# EAGLE design Adafruit_2.2_SPI_240x320 (EAGLE 6.3)
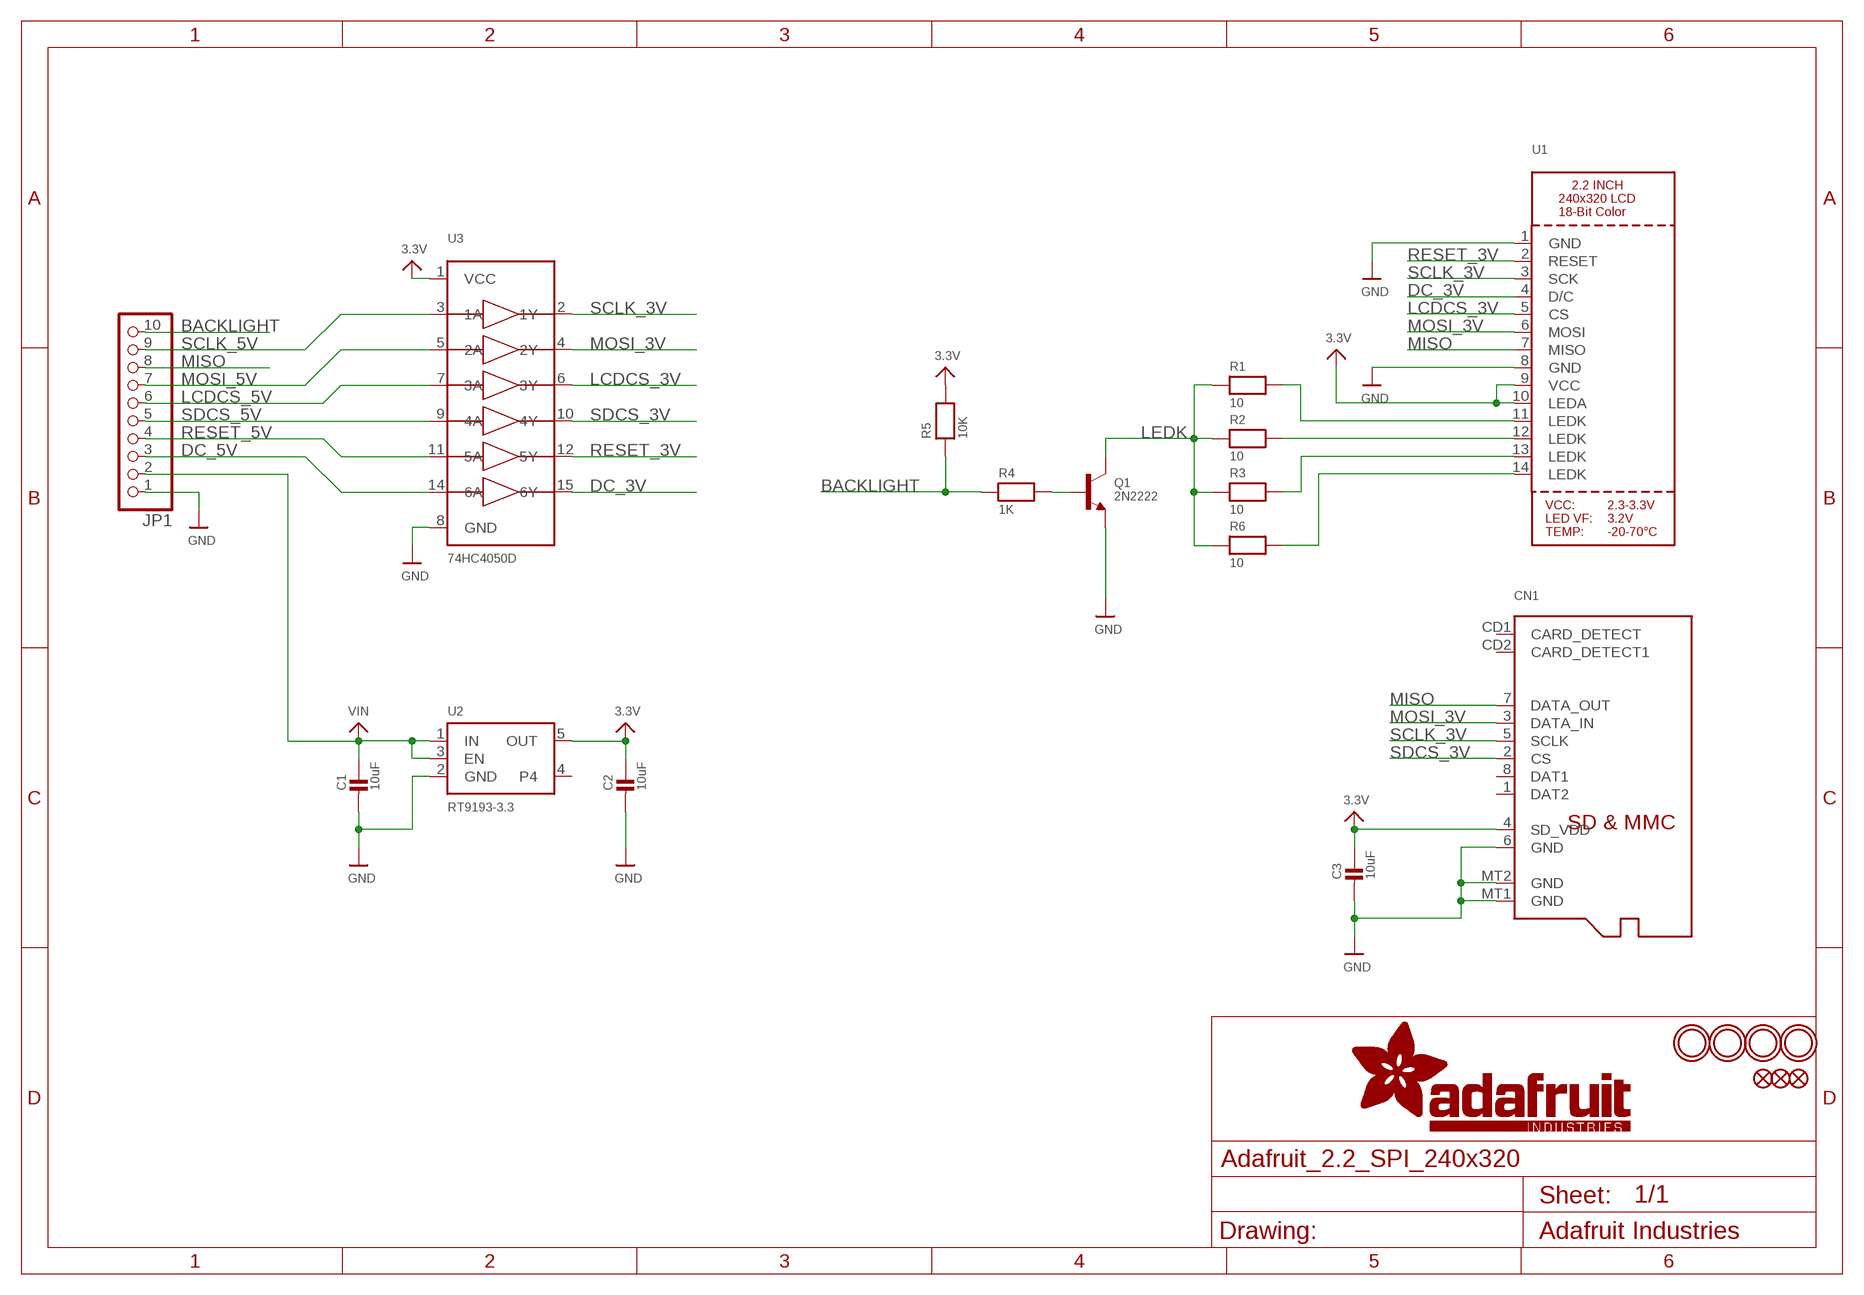
[diagram p0: schematic, sheet 1]

## Parts
C1  10uF  CAP_CERAMIC_0805MP  [_0805MP]
C2  10uF  CAP_CERAMIC_0805MP  [_0805MP]
C3  10uF  CAP_CERAMIC_0805MP  [_0805MP]
CN1  MICROSD  [MICROSD]
FID1  FIDUCIAL""  [FIDUCIAL_1MM]
FID2  FIDUCIAL""  [FIDUCIAL_1MM]
FID3  FIDUCIAL""  [FIDUCIAL_1MM]
JP1  HEADER-1X1070MIL  [1X10_ROUND70]
Q1  2N2222  TRANSISTOR_NPNWIDE  [SOT23-WIDE]
R1  10  RESISTOR_0805MP  [_0805MP]
R2  10  RESISTOR_0805MP  [_0805MP]
R3  10  RESISTOR_0805MP  [_0805MP]
R4  1K  RESISTOR_0805MP  [_0805MP]
R5  10K  RESISTOR_0805MP  [_0805MP]
R6  10  RESISTOR_0805MP  [_0805MP]
U1  DISP_LCD_TM022HDH26  [TM022HDH26_2.2IN_LCD]
U2  RT9193-3.3  VREG_SOT23-5  [SOT23-5]
U3  74HC4050D  [SOIC16]
U$2  MOUNTINGHOLE2.5  [MOUNTINGHOLE_2.5_PLATED]
U$3  MOUNTINGHOLE2.5  [MOUNTINGHOLE_2.5_PLATED]
U$4  MOUNTINGHOLE2.5  [MOUNTINGHOLE_2.5_PLATED]
U$5  MOUNTINGHOLE2.5  [MOUNTINGHOLE_2.5_PLATED]

## Nets
3.3V: C2.1 C3.1 CN1.4(SD_VDD) R5.2 U1.9(VCC) U1.10(LEDA) U2.5(OUT) U3.1(VCC)
BACKLIGHT: JP1.10 R4.1 R5.1
DC_3V: U1.4(D/C) U3.15(6Y)
DC_5V: JP1.3 U3.14(6A)
GND: C1.2 C2.2 C3.2 CN1.6(GND) CN1.MT1(GND) CN1.MT2(GND) JP1.1 Q1.2(E) U1.1(GND) U1.8(GND) U2.2(GND) U3.8(GND)
LCDCS_3V: U1.5(CS) U3.6(3Y)
LCDCS_5V: JP1.6 U3.7(3A)
LEDK: Q1.3(C) R1.1 R2.1 R3.1 R6.1
MISO: CN1.7(DATA_OUT) JP1.8 U1.7(MISO)
MOSI_3V: CN1.3(DATA_IN) U1.6(MOSI) U3.4(2Y)
MOSI_5V: JP1.7 U3.5(2A)
N$1: R1.2 U1.11(LEDK)
N$2: R2.2 U1.12(LEDK)
N$3: R3.2 U1.13(LEDK)
N$4: Q1.1(B) R4.2
N$5: R6.2 U1.14(LEDK)
RESET_3V: U1.2(RESET) U3.12(5Y)
RESET_5V: JP1.4 U3.11(5A)
SCLK_3V: CN1.5(SCLK) U1.3(SCK) U3.2(1Y)
SCLK_5V: JP1.9 U3.3(1A)
SDCS_3V: CN1.2(CS) U3.10(4Y)
SDCS_5V: JP1.5 U3.9(4A)
VIN: C1.1 JP1.2 U2.1(IN) U2.3(EN)
Unconnected: CN1.1(DAT2) CN1.8(DAT1) CN1.CD1(CARD_DETECT) CN1.CD2(CARD_DETECT1) U2.4

## Library data of the parts
C1-C3 = microbuilder:CAP_CERAMIC: Ceramic Capacitors For new designs, use the packages preceded by an '_' character since they are more reliable: The following footprints should be used on most boards: _0402 - Standard footprint for regular board layouts _0603 - Standard footprint for regular board layouts _0805 - Standard footprint for regular board layouts For extremely tight-pitch boards where space is at a premium, the following 'micro-pitch' footprints can be used (smaller pads, no silkscreen outline, etc.): _0402MP - Micro-pitch footprint for very dense/compact boards _0603MP - Micro-pitch footprint for very dense/compact boards _0805MP - Micro-pitch footprint for very dense/compact boards Commonly Stocked Parts 0402 - 0402 Surface Mount Capacitors 16pF 50V 5% [Digikey: 445-4899-2-ND] 18pF 50V 5% [Digikey: 490-1281-2-ND] 22pF 50V 5% [Digikey: 490-1283-2-ND] 68pF 50V 5% [Digikey: 490-1289-2-ND] 0.1uF 10V 10% [Digikey: 490-1318-2-ND] 1.0uF 6.3V 10% [Digikey: 490-1320-2-ND] 0603 - 0603 Surface Mount Capacitors 16 pF 50V 5% [Digikey: 445-5051-2-ND] 22 pF 50V [Digikey: PCC220ACVTR-ND] 33 pF 50V 5% [Digikey: 490-1415-1-ND] 56pF 50V 5% [Digikey: 490-1421-1-ND] 220pF 50V 5% [Digikey: 445-1285-1-ND] 680 pF 50V 2200 pF 50V 5% C0G [Digikey: 445-1297-1-ND] 5600 pF 100V 5% X7R [Digikey: 478-3711-1-ND] 0.1 µF 25V 10% [Digikey: PCC2277TR-ND] 0.22 µF 16V 10% X7R [Digikey: 445-1318-1-ND] 1.0 µF 25V 10% [Digikey: 445-5146-2-ND] 0603 - RF Specific 3pF 250V +/-0.1pF RF [Digikey: 712-1347-1-ND] 18 pF 250V 5% [Digikey: 478-3505-1-ND or 712-1322-1-ND] 56 pF 250V 5% C0G RF [Digikey: 490-4867-1-ND] 68 pF 250V RF [Digikey: 490-4868-1-ND] 0805 - 0805 Surface Mount Capacitors 220 pF 250V 2% RF Ceramic Capacitor [Digikey: 712-1398-1-ND] 1000 pF 50V 2% NP0 Ceramic Capacitor [Digikey: 478-3760-1-ND] 0.1 µF 25V 10% Ceramic Capacitor [Digikey: PCC1828TR-ND] 1.0 µF 16V 10% Ceramic Capacitor[Digikey: 490-1691-2-ND] 10.0 µF 10V 10% Ceramic Capacitor[Digikey: 709-1228-1-ND] 10.0 uF 16V 10% Ceramic Capacitor [Digikey: 478-5165-2-ND] 47 uF 6.3V 20% Ceramic Capacitor [Digikey: 587-1779-1-ND or 399-5506-1-ND] 1206 - 1206 Surface Mount Capacitors 47uF 10V 20% Ceramic Capacitor [Digikey: 490-5528-1-ND or 399-5508-1-ND or 445-6010-1-ND] 100uF 6.3V -20%, +80% Y5V Ceramic Capacitor (Digikey: 490-4512-1-ND, Mouser: 81-GRM31CF50J107ZE1L)
CN1 = microbuilder:MICROSD: MicroSD/Transflash Card Holder with SPI pinout 3M: 2908-05WB-MG 4UConnector: 19656 Footprint courtesy: Adafruit Industries
FID1-FID3 = microbuilder:FIDUCIAL: Fiducial Alignment Points Various fiducial points for machine vision alignment.; BOM: EXCLUDE
JP1 = microbuilder:HEADER-1X10: PIN HEADER
Q1 = microbuilder:TRANSISTOR_NPN: NPN Transistor Transistor (NPN) 500mA 45V - BC817 [Digikey: 568-1631-1-ND] Transistor (NPN) 500mA 45V - BC817,215 [Mouser: 771-BC817-T/R] SOT23-R - SOT23 footprint optimised for use with solder paste and reflow ovens. SOT23-W - SOT23 footprint optimised for hand-soldering (larger pads).
R1-R6 = microbuilder:RESISTOR: Resistors For new designs, use the packages preceded by an '_' character since they are more reliable: The following footprints should be used on most boards: _0402 - Standard footprint for regular board layouts _0603 - Standard footprint for regular board layouts _0805 - Standard footprint for regular board layouts For extremely tight-pitch boards where space is at a premium, the following 'micro-pitch' footprints can be used (smaller pads, no silkscreen outline, etc.): _0402MP - Micro-pitch footprint for very dense/compact boards _0603MP - Micro-pitch footprint for very dense/compact boards _0805MP - Micro-pitch footprint for very dense/compact boards
U1 = microbuilder:DISP_LCD_TM022HDH26: TM022HDH26 2.2 Inch 240x320 18-bit LCD - ILI9340C Controller
U2 = microbuilder:VREG_SOT23-5: SOT23-5 Fixed Voltage Regulators Part Current Out V Out V In V Dropout θJA (°C/W) TJ (°C) Digikey Part No. ADP121 150mA 3.3V 3.4-5.5V 0.09V @ 150mA -- -- ADP121-AUJZ33R7CT-ND ADP121 150mA 3.0V 3.1-5.5V 0.09V @ 150mA -- -- ADP121-AUJZ30R7CT-ND ADP122 300mA 3.3V 3.4-5.5V 0.085V @ 300mA -- -- ADP122AUJZ-3.3-R7CT-ND ADP1712 300mA 3.3V 3.5-5.5V 0.17V @ 300mA -- -- ADP1712AUJZ-3.3-R7TR-ND AP7311 (Low Cost) 150mA 3.3V 3.5-6V 0.15V @ 150mA -- -- AP7311-33WG-7DICT-ND LD39015M18R 150mA 1.8V 1.9V-5.5V 0.08V @ 100mA -- -- 497-6977-1-ND LP2985A-33DBVR 150mA 3.3V 3.3-16V 0.28V @ 150mA 206 150 296-18479-1-ND MCP1824T-3302E/OT 300mA 3.3V 3.5V-6V 0.2V @ 300mA -- -- MCP1824T-3302E/OTCT-ND MIC5205-2.5YM5 TR 150mA 2.5V 2.7-16V 0.165V @ 150mA -- -- 576-1257-2-ND MIC5205-3.0YM5 TR 150mA 3.0V 3.2V-16V 0.165V @ 150mA -- -- 576-1258-2-ND MIC5205-3.3YM5 TR 150mA 3.3V 3.5V-16V 0.165V @ 150mA -- -- 576-1259-2-ND TPS780330220 150mA 3.3V+2.2V 3.6-5.5V 250mV Max -- -- 296-23332-1-ND TDA3663/N1,135 100mA 3.3V 3.5-45V 0.18V @ 50mA -- -- 568-5343-1-ND Max operating temp can be calculated using θJA, TJ (max junction temperature), and power in watts. Set the "Maximum Ambient Temperature" until it reaches TJ ("Max Junction Temperature"), which is the absolute limit for safe use of the regulator: Heat Sink Temperature Calculator <http://www.daycounter.com/Calculators/Heat-Sink-Temperature-Calculator.phtml> For example, With 12V source into a 3.3V LP2985 and a 30mA load, we are dissipating (12V-3.3V) * 0.03A = 0.261W. With a θJA of 206 °C/W, a TJ of 150°C, and 261mW we can safely use the chip without a heat sink up to 75°C (=147.1°C Junction Temperature).
U3 = microbuilder:74HC4050D: 6-channel level shifter 74HC4050D - 2V-6V Supply SOIC16 Digikey: 74HC4050D,653-ND Mouser: 771-74HC4050D-T TSSOP16 Digikey: 296-9215-1-ND Mouser:
U$2-U$5 = microbuilder:MOUNTINGHOLE: Mounting Hole For #2 screws (0.086"/2.18mm width, 0.094"/2.4mm hole) use 2.5mm

## Board
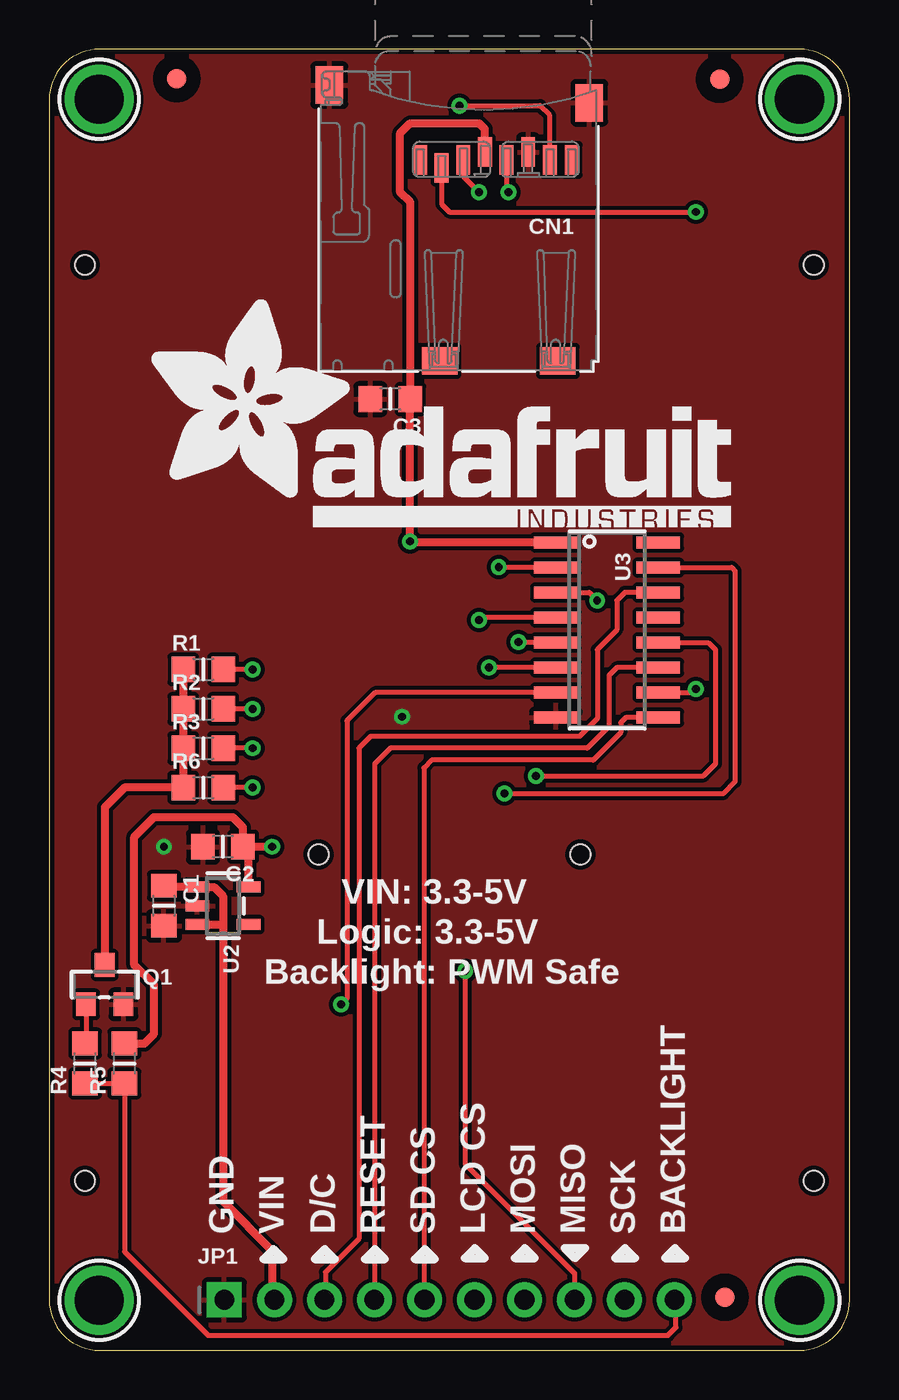
[diagram p1: board, top side]
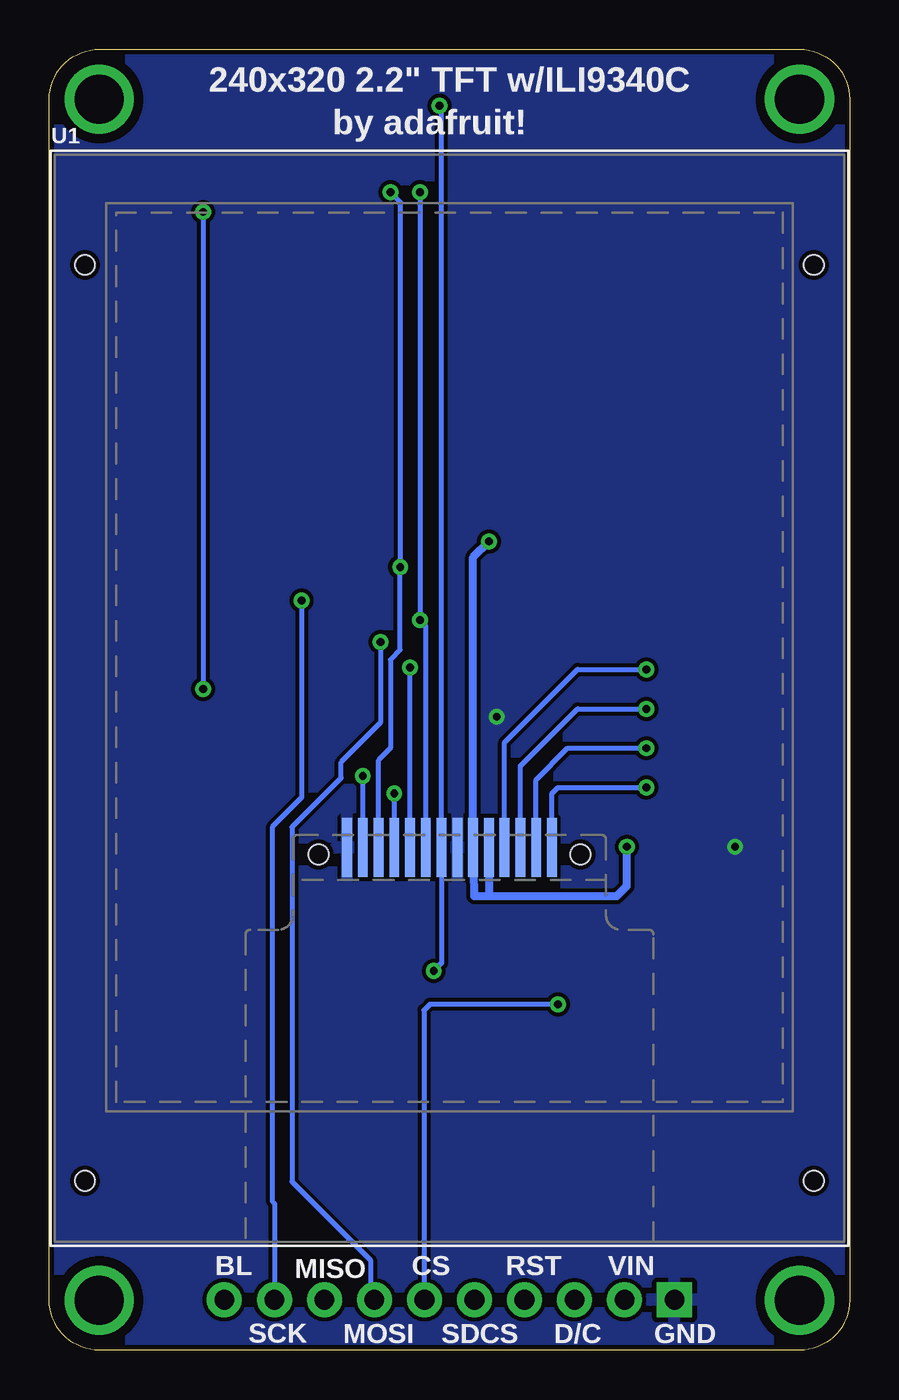
[diagram p2: board, bottom side, seen from below]

Size 40.64 x 66.04 mm. Coordinates in mm from the lower left corner, seen from the top.
Outline: 40.64,2.54 40.64,63.5 arc90 38.1,66.04 2.54,66.04 arc90 0,63.5 0,2.54 arc90 2.54,0 38.1,0 arc90 40.64,2.54
Copper layers (1*16): Top 0.035mm / dielectric 1.5mm / Bottom 0.035mm
Design rules "adafruit": minimum track width 8mil, minimum drill 15.5mil, track to track 8mil, track to pad 8mil, pad to pad 8mil, via to via 8mil, smd to smd 8mil, copper to edge 10mil, drill to drill 8mil, minimum pad ring 10mil, minimum via ring 8mil, stop-mask expansion 4mil, vias tented up to drill 20mil, thermal gap 10mil

### Footprints (pad centres in the part's own frame; a part is rotated, then mirrored left to right if it is on the bottom)
_0805MP = smd 1.2 x 1.3: 1 -1.016,0; 2 1.016,0
MICROSD = smd 0.7 x 1.5: 1 9,-10.64; 2 7.9,-10.24; 3 6.8,-10.64; 4 5.7,-11.04; 5 4.6,-10.64; 6 3.5,-11.04; 7 2.4,-10.64; 8 1.3,-10.64 | smd 1.8 x 1.4: CD1 2,-0.44; CD2 8,-0.44 | smd 1.4 x 1.9: MT1 0.4,-13.54; MT2 13.6,-14.44
FIDUCIAL_1MM = smd 1 x 1: 1 0,0
1X10_ROUND70 = drill 1 pad 1.778 square: 1 -11.43,0 | drill 1 pad 1.778: 2 -8.89,0; 3 -6.35,0; 4 -3.81,0; 5 -1.27,0; 6 1.27,0; 7 3.81,0; 8 6.35,0; 9 8.89,0; 10 11.43,0
SOT23-WIDE = smd 1 x 1.2: 1 -0.95,-1; 2 0.95,-1; 3 0,1
TM022HDH26_2.2IN_LCD = smd 0.5 x 3: 1 -5.2,-9.66; 2 -4.4,-9.66; 3 -3.6,-9.66; 4 -2.8,-9.66; 5 -2,-9.66; 6 -1.2,-9.66; 7 -0.4,-9.66; 8 0.4,-9.66; 9 1.2,-9.66; 10 2,-9.66; 11 2.8,-9.66; 12 3.6,-9.66; 13 4.4,-9.66; 14 5.2,-9.66 | hole 1: -6.65,-10.01; 6.65,-10.01; 18.5,19.92; -18.5,19.92; -18.5,-26.58; 18.5,-26.58
SOT23-5 = smd 0.55 x 1.2: 1 -0.95,-1.3; 2 0,-1.3; 3 0.95,-1.3; 4 0.95,1.3; 5 -0.95,1.3
SOIC16 = smd 0.6 x 2.2: 1 -4.445,-2.6; 2 -3.175,-2.6; 3 -1.905,-2.6; 4 -0.635,-2.6; 5 0.635,-2.6; 6 1.905,-2.6; 7 3.175,-2.6; 8 4.445,-2.6; 9 4.445,2.6; 10 3.175,2.6; 11 1.905,2.6; 12 0.635,2.6; 13 -0.635,2.6; 14 -1.905,2.6; 15 -3.175,2.6; 16 -4.445,2.6
MOUNTINGHOLE_2.5_PLATED = drill 2.5 pad 3.2: P$1 0,0

### Placement (x,y rotation side)
C1  5.82,22.56 270 top
C2  8.82,25.56 180 top
C3  17.32,48.28 180 top
CN1  27.82,49.78 180 top
FID1  34.3,2.69 0 top
FID2  6.47,64.55 0 top
FID3  34.04,64.52 0 top
JP1  20.32,2.56 0 top
Q1  2.82,18.56 0 top
R1  7.82,34.56 0 top
R2  7.82,32.56 0 top
R3  7.82,30.56 0 top
R4  1.82,14.56 90 top
R5  3.82,14.56 90 top
R6  7.82,28.56 0 top
U1  20.32,35.18 0 bottom
U2  8.82,22.56 270 top
U3  28.32,36.56 270 top
U$2  2.54,2.54 0 top
U$3  38.1,63.5 0 top
U$4  2.54,63.5 0 top
U$5  38.1,2.54 0 top
U$20  [ADAFRUIT_TEXT_30MM]  4.96,41.8 0 top

### Tracks (layer width: path | path; a pad name or v marks a point on that pad's centre or on a via)
3.3V  (via drill 0.4)
  Top 0.406: v11.32,25.56 C2.1 | U2.5 10.12,25.28 C2.1 | R5.2 4.84,15.58 5.32,16.06 5.32,18.56 4.32,19.56 4.32,26.06 5.32,27.06 9.32,27.06 9.82,26.56 9.82,25.58 C2.1 | U3.1 18.38,41.01 v18.32,41.06 18.32,48.27 C3.1 18.34,58.27 17.82,58.78 17.82,61.78 18.32,62.28 21.82,62.28 22.12,61.98 CN1.4
  Bottom 0.406: U1.10 18.32,23.06 | 18.32,23.06 11.82,23.06 11.32,23.56 v11.32,25.56 | 18.32,23.06 19.07,23.06 U1.9 19.12,40.26 v18.32,41.06
BACKLIGHT
  Top 0.254: R4.1 R5.1 3.82,5 8.06,0.76 31.42,0.76 31.82,1.16 31.82,2.49 JP1.10
DC_3V  (via drill 0.4)
  Top 0.254: v23.12,28.26 34.22,28.26 34.82,28.86 34.82,39.56 34.64,39.73 U3.15
  Bottom 0.254: U1.4 v23.12,28.26
DC_5V
  Top 0.254: U3.14 29.23,38.47 28.82,38.06 28.82,36.56 27.82,35.56 27.82,32.06 26.92,31.16 16.32,31.16 15.72,30.56 15.72,5.66 14.02,3.96 14.02,2.61 JP1.3
GND  (via drill 0.4)
  other vias: 17.92,32.16 5.82,25.56
  pour Bottom (isolate 0.203): -1.18,-0.44 -1.18,67.56 41.82,67.56 41.82,-0.44
  pour Top (isolate 0.203): 1.32,-0.44 arc-90 -1.18,2.06 -1.18,65.06 arc-90 1.32,67.56 39.32,67.56 arc-90 41.82,65.06 41.82,2.06 arc-90 39.32,-0.44
LCDCS_3V  (via drill 0.4)
  Top 0.254: U3.6 22.62,34.66 v22.32,34.66
  Bottom 0.254: U1.5 v22.32,34.66
LCDCS_5V  (via drill 0.4)
  Top 0.254: U3.7 16.55,33.39 15.12,31.96 15.12,17.86 v14.82,17.56
  Bottom 0.254: v14.82,17.56 21.32,17.56 21.62,17.26 21.62,2.59 JP1.6
LEDK
  Top 0.406: R1.1 R2.1 R3.1 R6.1 3.82,28.56 2.82,27.56 Q1.3
MISO  (via drill 0.4)
  Top 0.254: v20.82,63.18 24.92,63.18 25.42,62.68 CN1.7 | v21.12,19.26 21.12,9.46 26.67,3.91 JP1.8
  Bottom 0.254: v20.82,63.18 20.72,63.08 U1.7 20.72,19.66 v21.12,19.26
MOSI_3V  (via drill 0.4)
  Top 0.254: U3.4 21.96,37.2 v21.82,37.06 | CN1.3 21.02,59.58 v21.82,58.78
  Bottom 0.254: U1.6 21.52,36.76 v21.82,37.06 v21.82,58.78
MOSI_5V  (via drill 0.4)
  Top 0.254: U3.5 23.95,35.93 v23.82,35.96
  Bottom 0.254: v23.82,35.96 23.82,31.86 25.82,29.86 25.82,29.06 28.32,26.56 28.32,8.56 24.32,4.56 24.32,2.75 JP1.7
N$1  (via drill 0.4)
  Top 0.254: v10.32,34.56 R1.2
  Bottom 0.254: U1.11 17.52,30.86 13.82,34.56 v10.32,34.56
N$2  (via drill 0.4)
  Top 0.254: v10.32,32.56 R2.2
  Bottom 0.254: U1.12 16.72,29.66 13.82,32.56 v10.32,32.56
N$3  (via drill 0.4)
  Top 0.254: v10.32,30.56 R3.2
  Bottom 0.254: U1.13 15.92,28.96 14.32,30.56 v10.32,30.56
N$4
  Top 0.254: Q1.1 1.87,15.63 R4.2
N$5  (via drill 0.4)
  Top 0.254: v10.32,28.56 R6.2
  Bottom 0.254: U1.14 15.12,28.26 14.82,28.56 v10.32,28.56
RESET_3V  (via drill 0.4)
  Top 0.254: v24.72,29.16 33.22,29.16 33.82,29.76 33.82,35.56 33.45,35.93 U3.12
  Bottom 0.254: U1.2 v24.72,29.16
RESET_5V
  Top 0.254: U3.11 28.81,34.66 28.42,34.26 28.42,31.66 27.32,30.56 17.32,30.56 16.52,29.76 JP1.4
SCLK_3V  (via drill 0.4)
  Top 0.254: U3.2 23,39.73 v22.82,39.76 | CN1.5 23.22,58.88 v23.32,58.78
  Bottom 0.254: v23.32,58.78 22.82,58.28 v22.82,39.76 22.82,35.56 23.32,35.06 23.32,30.56 23.92,29.96 U1.3
SCLK_5V  (via drill 0.4)
  Top 0.254: U3.3 27.41,38.47 v27.82,38.06
  Bottom 0.254: v27.82,38.06 27.82,28.06 29.32,26.56 29.32,7.56 29.21,7.45 JP1.9
SDCS_3V  (via drill 0.4)
  Top 0.254: CN1.2 19.92,58.18 20.32,57.78 v32.82,57.78 | U3.10 32.64,33.39 v32.82,33.56
  Bottom 0.254: v32.82,57.78 v32.82,33.56
SDCS_5V
  Top 0.254: U3.9 29.27,32.12 29.02,31.86 29.02,31.36 27.62,29.96 19.42,29.96 19.02,29.56 19.02,2.59 JP1.5
VIN
  Top 0.406: C1.1 5.89,23.51 U2.1 8.37,23.51 8.82,23.06 8.82,21.56 | 8.82,21.56 8.82,7.56 11.32,5.06 11.32,2.67 JP1.2 | U2.3 8.77,21.61 8.82,21.56

### Text on the board
tPlace: VIN: 3.3-5V | Logic: 3.3-5V | Backlight: PWM Safe | GND | VIN | D/C | RESET | SD CS | LCD CS | MOSI | MISO | SCK | BACKLIGHT
bPlace: 240x320 2.2" TFT w/ILI9340C | by adafruit! | VIN | RST | CS | MISO | BL | GND | D/C | SDCS | MOSI | SCK